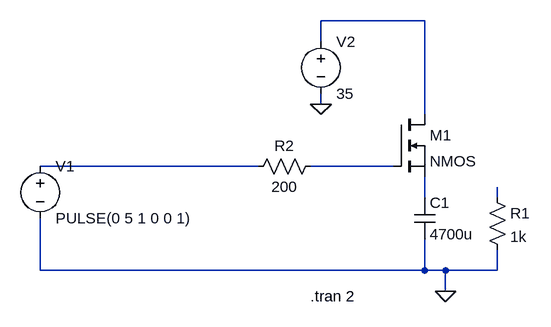
[diagram p0: schematic Draft1.asc]
Draft1.asc, the LTspice schematic file:
Version 4
SHEET 1 880 680
WIRE 272 -128 112 -128
WIRE 112 -96 112 -128
WIRE 112 0 112 -16
WIRE 272 16 272 -128
WIRE 16 96 -320 96
WIRE 224 96 96 96
WIRE 272 144 272 112
WIRE 384 144 384 128
WIRE -320 256 -320 176
WIRE 272 256 272 208
WIRE 272 256 -320 256
WIRE 304 256 272 256
WIRE 384 256 384 224
WIRE 384 256 304 256
WIRE 304 288 304 256
FLAG 304 288 0
FLAG 112 0 0
SYMBOL voltage -320 80 R0
WINDOW 123 0 0 Left 0
WINDOW 39 0 0 Left 0
SYMATTR InstName V1
SYMATTR Value PULSE(0 5 1 0 0 1)
SYMBOL cap 256 144 R0
SYMATTR InstName C1
SYMATTR Value 4700u
SYMBOL res 368 128 R0
SYMATTR InstName R1
SYMATTR Value 1k
SYMBOL nmos 224 16 R0
SYMATTR InstName M1
SYMBOL voltage 112 -112 R0
WINDOW 123 0 0 Left 0
WINDOW 39 0 0 Left 0
SYMATTR InstName V2
SYMATTR Value 35
SYMBOL res 112 80 R90
WINDOW 0 0 56 VBottom 2
WINDOW 3 32 56 VTop 2
SYMATTR InstName R2
SYMATTR Value 200
TEXT 96 296 Left 2 !.tran 2

The netlist it stands for:
* Draft1.asc
V1 N002 0 PULSE(0 5 1 0 0 1)
C1 N004 0 4700u
R1 N005 0 1k
M1 N001 N003 N004 N004 NMOS
V2 N001 0 35
R2 N003 N002 200
.model NMOS NMOS
.model PMOS PMOS
.lib standard.mos
.tran 2
.backanno
.end